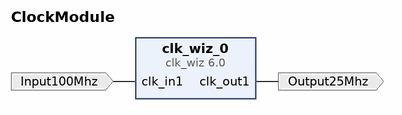
[diagram p0: block diagram of the top level]
# Vivado block design ClockModule, xc7s25csga324-1, Vivado 2023.2
create_bd_design ClockModule

create_bd_port -dir O -type clk Output25Mhz
create_bd_port -dir I -type clk Input100Mhz
set_property -dict {CONFIG.FREQ_HZ 100000000} [get_bd_ports Input100Mhz]

create_bd_cell -type ip -vlnv xilinx.com:ip:clk_wiz:6.0 clk_wiz_0
set_property -dict [list \
  CONFIG.CLKOUT1_JITTER 181.828 \
  CONFIG.CLKOUT1_PHASE_ERROR 104.359 \
  CONFIG.CLKOUT1_REQUESTED_OUT_FREQ 25.000 \
  CONFIG.MMCM_CLKFBOUT_MULT_F 9.125 \
  CONFIG.MMCM_CLKOUT0_DIVIDE_F 36.500 \
  CONFIG.PRIM_IN_FREQ 100.000 \
  CONFIG.USE_LOCKED false \
  CONFIG.USE_RESET false \
] [get_bd_cells clk_wiz_0]

# ---- connections ----

connect_bd_net [get_bd_ports Input100Mhz] [get_bd_pins clk_wiz_0/clk_in1]
connect_bd_net [get_bd_pins clk_wiz_0/clk_out1] [get_bd_ports Output25Mhz]

validate_bd_design
save_bd_design
